# EAGLE design BusPirate-v3.8a-SSOP (EAGLE 6.3)
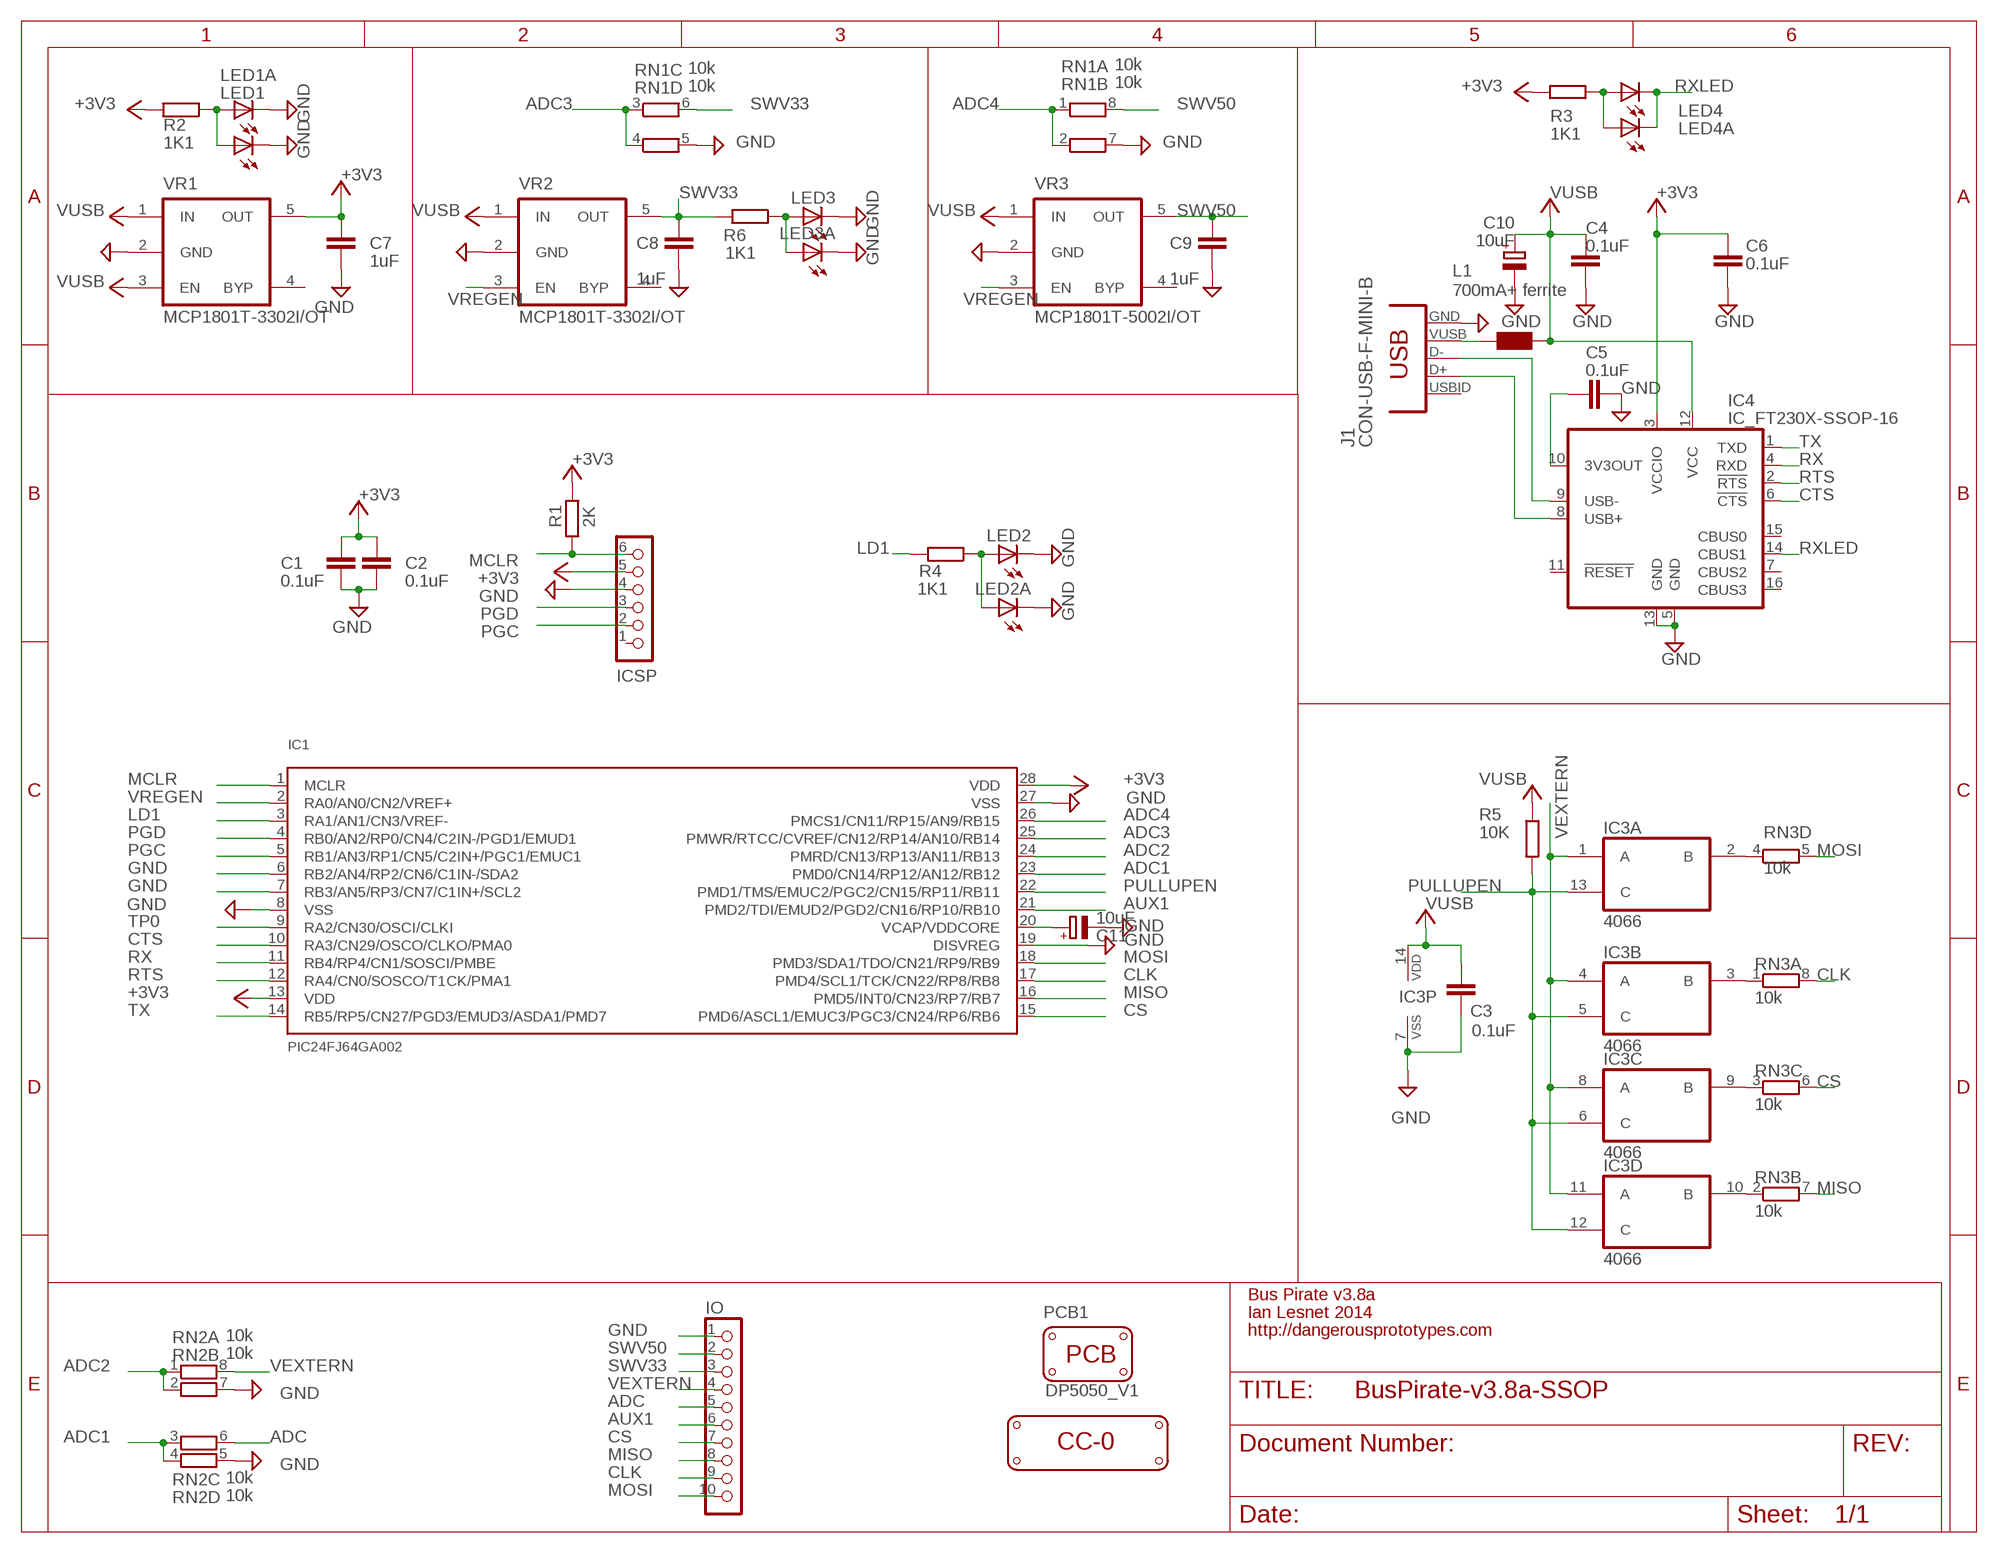
[diagram p0: schematic, sheet 1]

## Parts
C1  0.1uF  CAPC603  [C603]
C2  0.1uF  CAPC603  [C603]
C3  0.1uF  CAPC603  [C603]
C4  0.1uF  CAPC603  [C603]
C5  0.1uF  CAPC603  [C603]
C6  0.1uF  CAPC603  [C603]
C7  1uF  CAPC603  [C603]
C8  1uF  CAPC603  [C603]
C9  1uF  CAPC603  [C603]
C10  10uF  CPOL-EUSMCA  [SMC_A]
C11  10uF  CPOL-EUSMCA  [SMC_A]
IC1  PIC24FJ64GA002  [SSOP28]
IC3  4066  [TSSOP14]
IC4  IC_FT230X-SSOP-16  [SSOP-16-FTDI]
ICSP  CON_HEADER_1X06-SMD-RIGHT-ANGLED  [M1X6_MALE_RIGHT_ANGLED_SMD]
IO  CON_HEADER_1X10-_RIGHTANGLED_SMD  [M1X10_MALE_RIGHT_ANGLED_SMD]
J1  CON-USB-F-MINI-B  [CONN_USB_MINI-B]
L1  700mA+ ferrite  WE-KIL_0805  [WE-KI_0805_B]
LED1  LED-0603  [LED-603]
LED1A  LED-0603  [LED-603]
LED2  LED-0603  [LED-603]
LED2A  LED-0603  [LED-603]
LED3  LED-0603  [LED-603]
LED3A  LED-0603  [LED-603]
LED4  LED-0603  [LED-603]
LED4A  LED-0603  [LED-603]
LOGO1  LOGO_CC-0  [LOGO_CC-0]
PCB1  PCB_DP_SQUARE-5X5  [DP5050_V1]
R1  2K  RESISTORR603  [R603]
R2  1K1  RESISTORR603  [R603]
R3  1K1  RESISTORR603  [R603]
R4  1K1  RESISTORR603  [R603]
R5  10K  RESISTORR603  [R603]
R6  1K1  RESISTORR603  [R603]
RN1  10k  RNETWORK  [RN8P-4R-CRA06S]
RN2  10k  RNETWORK  [RN8P-4R-CRA06S]
RN3  10k  RNETWORK  [RN8P-4R-CRA06S]
VR1  MCP1801T-3302I/OT  MIC5205  [SOT-23-5]
VR2  MCP1801T-3302I/OT  MIC5205  [SOT-23-5]
VR3  MCP1801T-5002I/OT  MIC5205  [SOT-23-5]

## Nets
$N26: J1.VUSB L1.2
+3V3: C1.1 C2.1 C6.1 C7.1 IC1.13(VDD) IC1.28(VDD) IC4.3(VCCIO) ICSP.5 R1.2 R2.2 R3.2 VR1.5(OUT) ; supply symbol labelled SUPPLY_+3V3
ADC: IO.5 RN2.6
ADC1: IC1.23(PMD0/CN14/RP12/AN12/RB12) RN2.3 RN2.4
ADC2: IC1.24(PMRD/CN13/RP13/AN11/RB13) RN2.1 RN2.2
ADC3: IC1.25(PMWR/RTCC/CVREF/CN12/RP14/AN10/RB14) RN1.3 RN1.4
ADC4: IC1.26(PMCS1/CN11/RP15/AN9/RB15) RN1.1 RN1.2
AUX1: IC1.21(PMD2/TDI/EMUD2/PGD2/CN16/RP10/RB10) IO.6
CLK: IC1.17(PMD4/SCL1/TCK/CN22/RP8/RB8) IO.9 RN3.8
CS: IC1.15(PMD6/ASCL1/EMUC3/PGC3/CN24/RP6/RB6) IO.7 RN3.6
CTS: IC1.10(RA3/CN29/OSCO/CLKO/PMA0) IC4.6(!CTS)
GND: C1.2 C2.2 C3.2 C4.2 C5.2 C6.2 C7.2 C8.2 C9.2 C10.- C11.- IC1.6(RB2/AN4/RP2/CN6/C1IN-/SDA2) IC1.7(RB3/AN5/RP3/CN7/C1IN+/SCL2) IC1.8(VSS) IC1.19(DISVREG) IC1.27(VSS) IC3.7(P:VSS) IC4.5(GND) IC4.13(GND) ICSP.4 IO.1 J1.GND LED1.C LED1A.C LED2.C LED2A.C LED3.C LED3A.C RN1.5 RN1.7 RN2.5 RN2.7 VR1.2(GND) VR2.2(GND) VR3.2(GND)
LD1: IC1.3(RA1/AN1/CN3/VREF-) R4.2
MCLR: IC1.1(MCLR) ICSP.6 R1.1
MISO: IC1.16(PMD5/INT0/CN23/RP7/RB7) IO.8 RN3.7
MOSI: IC1.18(PMD3/SDA1/TDO/CN21/RP9/RB9) IO.10 RN3.5
N$1: IC3.2(A:B) RN3.4
N$2: IC3.9(C:B) RN3.3
N$3: C11.+ IC1.20(VCAP/VDDCORE)
N$4: IC3.10(D:B) RN3.2
N$5: IC3.3(B:B) RN3.1
N$6: LED2.A LED2A.A R4.1
N$7: LED1.A LED1A.A R2.1
N$8: C5.1 IC4.10(3V3OUT)
N$13: LED4.A LED4A.A R3.1
N$15: IC4.8(USB+) J1.D+
N$16: IC4.9(USB-) J1.D-
N$18: LED3.A LED3A.A R6.1
PGC: IC1.5(RB1/AN3/RP1/CN5/C2IN+/PGC1/EMUC1) ICSP.2
PGD: IC1.4(RB0/AN2/RP0/CN4/C2IN-/PGD1/EMUD1) ICSP.3
PULLUPEN: IC1.22(PMD1/TMS/EMUC2/PGC2/CN15/RP11/RB11) IC3.5(B:C) IC3.6(C:C) IC3.12(D:C) IC3.13(A:C) R5.2
RTS: IC1.12(RA4/CN0/SOSCO/T1CK/PMA1) IC4.2(!RTS)
RX: IC1.11(RB4/RP4/CN1/SOSCI/PMBE) IC4.4(RXD)
RXLED: IC4.14(CBUS1) LED4.C LED4A.C
SWV33: C8.1 IO.3 R6.2 RN1.6 VR2.5(OUT)
SWV50: C9.1 IO.2 RN1.8 VR3.5(OUT)
TP0: IC1.9(RA2/CN30/OSCI/CLKI)
TX: IC1.14(RB5/RP5/CN27/PGD3/EMUD3/ASDA1/PMD7) IC4.1(TXD)
VEXTERN: IC3.1(A:A) IC3.4(B:A) IC3.8(C:A) IC3.11(D:A) IO.4 RN2.8
VREGEN: IC1.2(RA0/AN0/CN2/VREF+) VR2.3(EN) VR3.3(EN)
VUSB: C3.1 C4.1 C10.+ IC3.14(P:VDD) IC4.12(VCC) L1.1 R5.1 VR1.1(IN) VR1.3(EN) VR2.1(IN) VR3.1(IN) ; supply symbol labelled SUPPLY_VUSB
Unconnected: IC4.7(CBUS2) IC4.11(!RESET) IC4.15(CBUS0) IC4.16(CBUS3) ICSP.1 J1.BODY@1(BODY) J1.BODY@2(BODY) J1.BODY@3(BODY) J1.BODY@4(BODY) J1.ID(USBID) VR1.4(BYP) VR2.4(BYP) VR3.4(BYP)

## Notes on the sheet
- Bus Pirate v3.8a
- Ian Lesnet 2014
- http://dangerousprototypes.com

## Library data of the parts
C1-C9 = dp_devices:CAP
C10 C11 = rcl:CPOL-EU: POLARIZED CAPACITOR, European symbol
IC1 = dp_devices:PIC24FJ64GA002: 16-bit General Purpose Flash Microcontroller
IC3 = 40xx:4066: Quad bilateral ANALOG SWITCH
IC4 = dp_devices.v6:IC_FT230X: BASIC USB to UART IC
ICSP = dp_devices.v6:CON_HEADER_1X06
IO = dp_devices.v6:CON_HEADER_1X10
J1 = dp_devices.v6:CON-USB-F: USB Female connector
L1 = wuerth-elektronik:WE-KIL: SMD Wire Wound Ceramic Inductor WE-KIL - Low profile - High Q values -- Bluetooth -- Wireless LAN -- RF oscillation circuit -- IF impedance matching
LED1 LED1A LED2 LED2A LED3 LED3A LED4 LED4A = dp_devices:LED: Light Emitting Diode
LOGO1 = dp_devices:LOGO_CC-0
PCB1 = dp_devices.v6:PCB_DP_SQUARE: Dangerous Prototypes Standard Square PCB sizes; PCB_SIZE: DP5050_V1
R1-R6 = dp_devices:RESISTOR
RN1-RN3 = dp_devices:RNETWORK: 4 Resistor Array 0603
VR1-VR3 = dp_devices:MIC5205: 150ma Low-Noise LDO Regulator

## Board
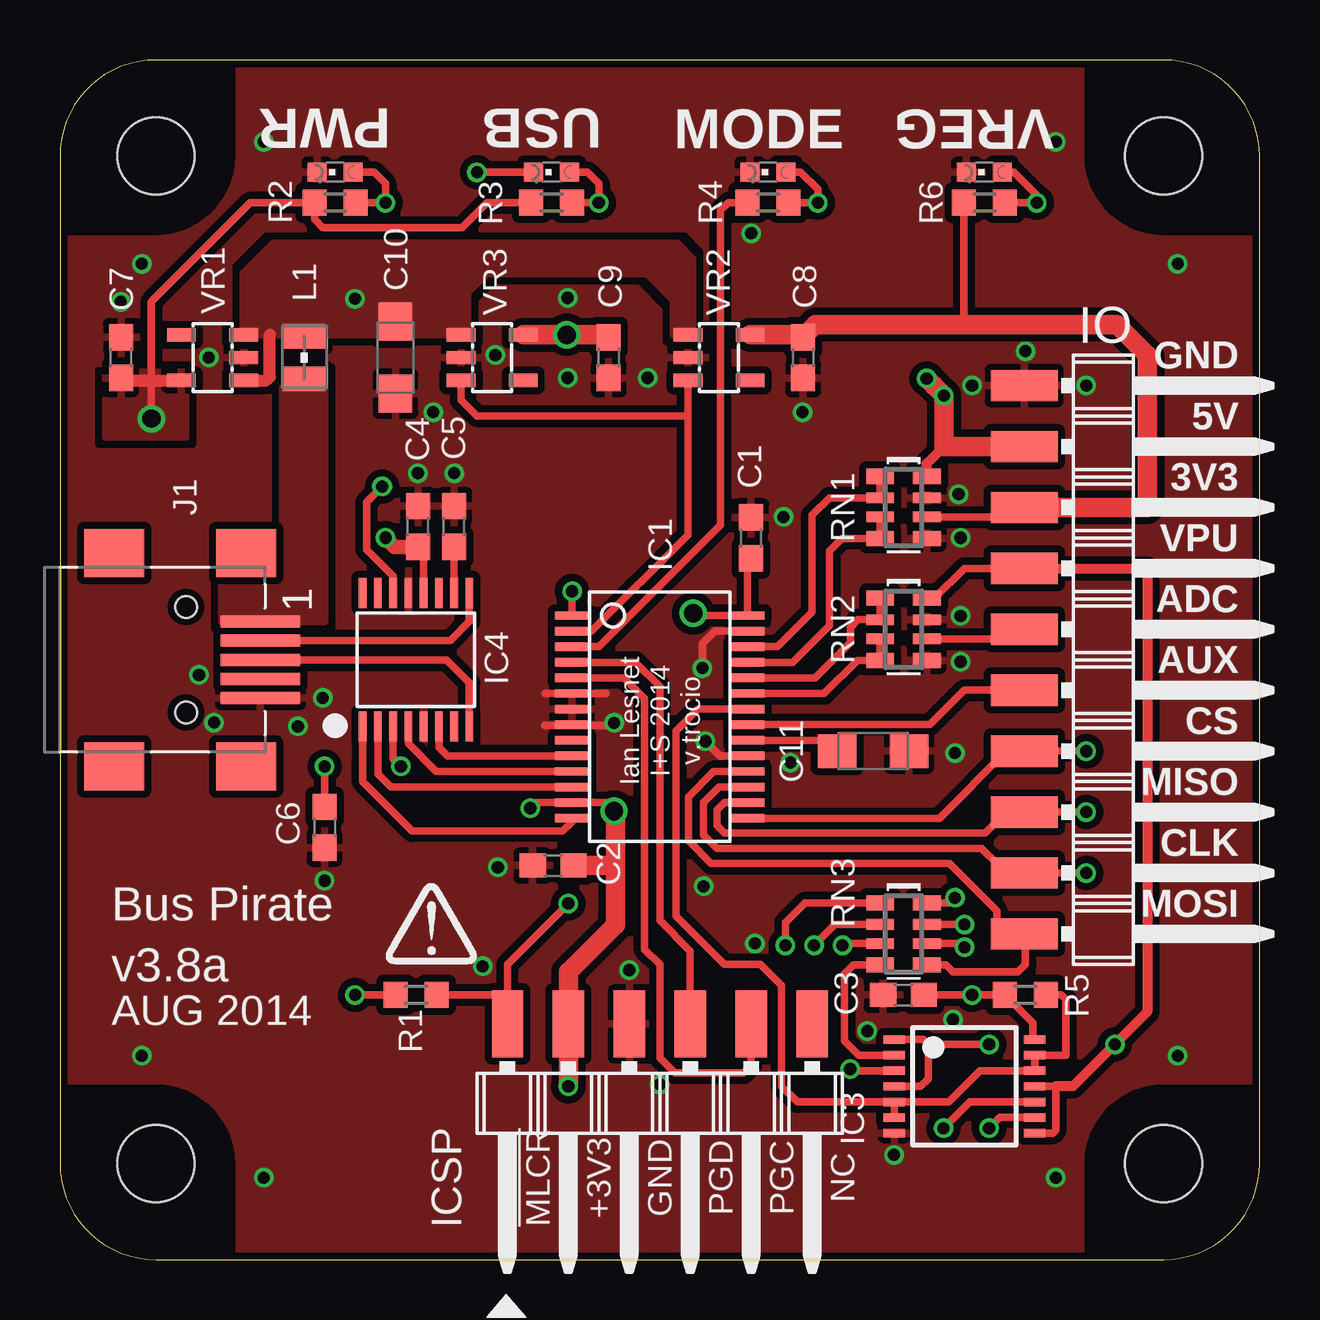
[diagram p1: board, top side]
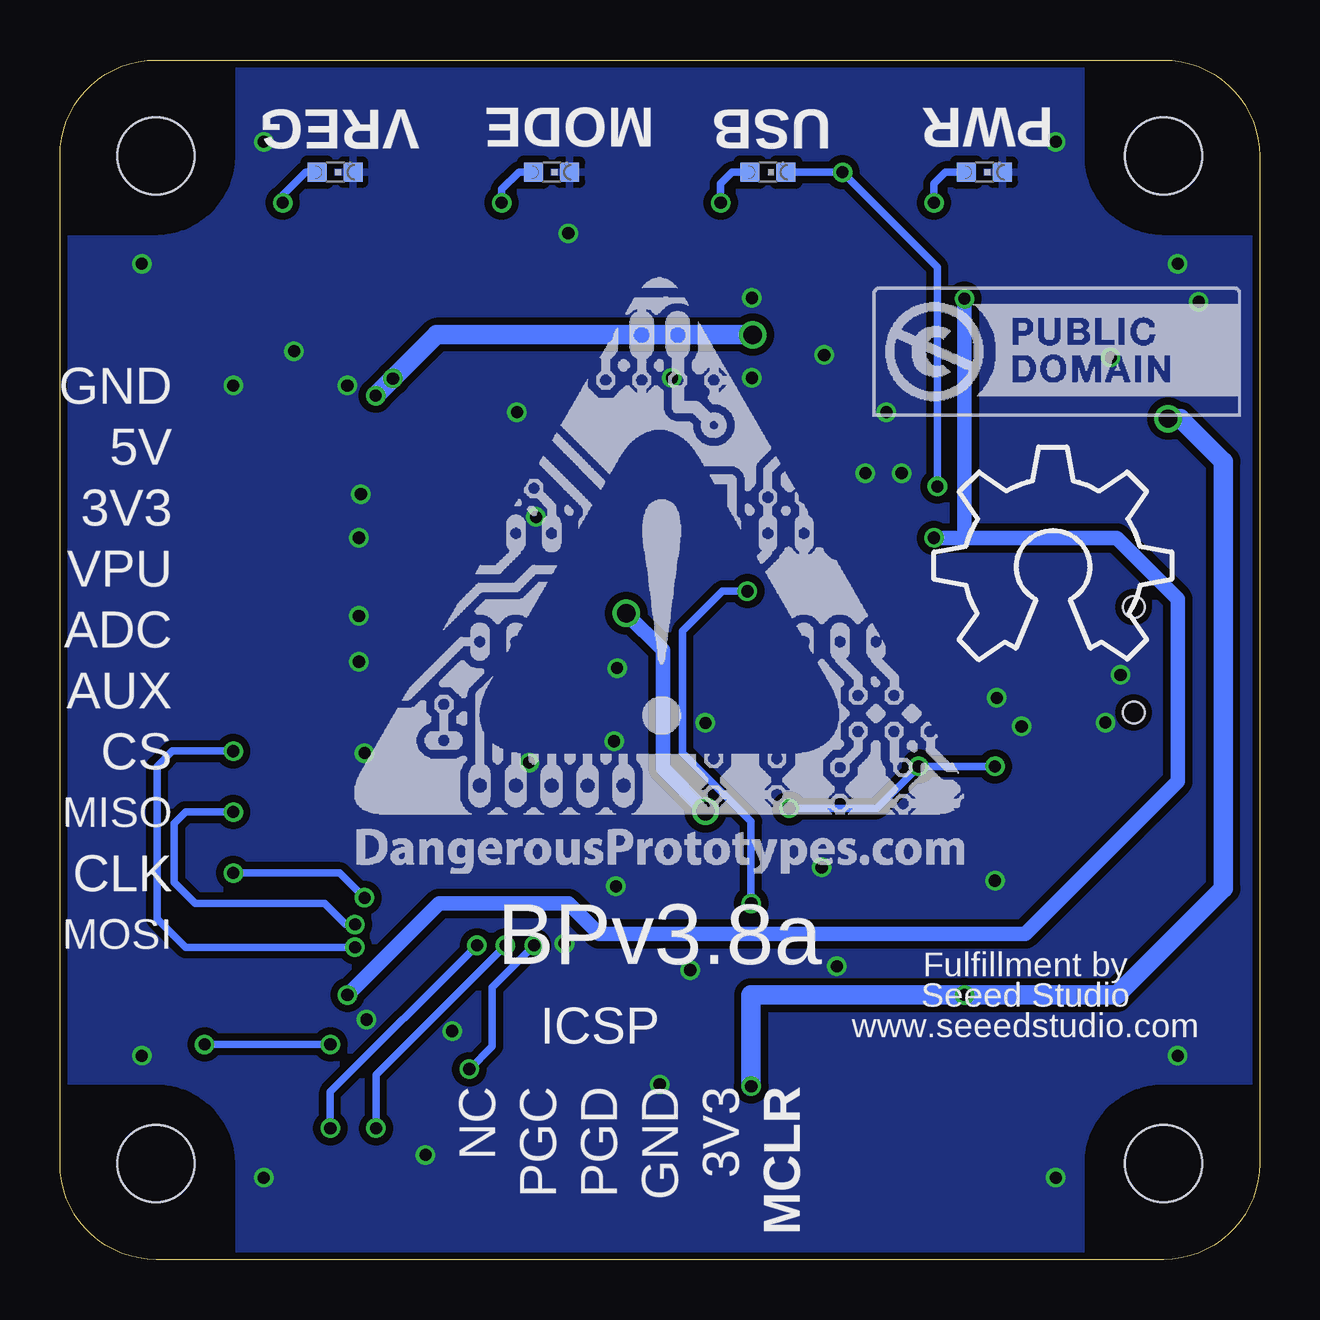
[diagram p2: board, bottom side, seen from below]

Size 50 x 50 mm. Coordinates in mm from the lower left corner, seen from the top.
Copper layers (1*16): Top 0.035mm / dielectric 1.5mm / Bottom 0.035mm
Design rules "dirt_cheap_dirty_boards.v1": minimum track width 5mil, minimum drill 12mil, track to track 5mil, track to pad 5mil, pad to pad 5mil, via to via 5mil, smd to smd 0mil, copper to edge 10mil, drill to drill 10mil, minimum pad ring 10mil, minimum via ring 6mil, stop-mask expansion 2mil, vias tented up to drill 25mil, thermal gap 10mil

### Footprints (pad centres in the part's own frame; a part is rotated, then mirrored left to right if it is on the bottom)
C603 = smd 1.1 x 1: 1 -0.85,0; 2 0.85,0
SMC_A = smd 1.6 x 1.4: + -1.5,0; - 1.5,0
SSOP28 = smd 0.348 x 1.397: 1 -4.225,-3.656; 2 -3.575,-3.656; 3 -2.925,-3.656; 4 -2.275,-3.656; 5 -1.625,-3.656; 6 -0.975,-3.656; 7 -0.325,-3.656; 8 0.325,-3.656; 9 0.975,-3.656; 10 1.625,-3.656; 11 2.275,-3.656; 12 2.925,-3.656; 13 3.575,-3.656; 14 4.225,-3.656; 15 4.225,3.656; 16 3.575,3.656; 17 2.925,3.656; 18 2.275,3.656; 19 1.625,3.656; 20 0.975,3.656; 21 0.325,3.656; 22 -0.325,3.656; 23 -0.975,3.656; 24 -1.625,3.656; 25 -2.275,3.656; 26 -2.925,3.656; 27 -3.575,3.656; 28 -4.225,3.656
TSSOP14 = smd 0.35 x 0.9: 1 -1.95,-2.925; 2 -1.3,-2.925; 3 -0.65,-2.925; 4 0,-2.925; 5 0.65,-2.925; 6 1.3,-2.925; 7 1.95,-2.925; 8 1.95,2.925; 9 1.3,2.925; 10 0.65,2.925; 11 0,2.925; 12 -0.65,2.925; 13 -1.3,2.925; 14 -1.95,2.925
SSOP-16-FTDI = smd 0.32 x 1.26: 1 -2.223,-2.779; 2 -1.588,-2.779; 3 -0.953,-2.779; 4 -0.318,-2.779; 5 0.317,-2.779; 6 0.952,-2.779; 7 1.587,-2.779; 8 2.222,-2.779; 9 2.222,2.779; 10 1.587,2.779; 11 0.952,2.779; 12 0.317,2.779; 13 -0.318,2.779; 14 -0.953,2.779; 15 -1.588,2.779; 16 -2.223,2.779
M1X6_MALE_RIGHT_ANGLED_SMD = smd 1.3 x 2.8: 1 -6.35,-3.3; 2 -3.81,-3.3; 3 -1.27,-3.3; 4 1.27,-3.3; 5 3.81,-3.3; 6 6.35,-3.3
M1X10_MALE_RIGHT_ANGLED_SMD = smd 1.3 x 2.8: 1 -11.43,-3.3; 2 -8.89,-3.3; 3 -6.35,-3.3; 4 -3.81,-3.3; 5 -1.27,-3.3; 6 1.27,-3.3; 7 3.81,-3.3; 8 6.35,-3.3; 9 8.89,-3.3; 10 11.43,-3.3
CONN_USB_MINI-B = smd 2 x 2.5: BODY@1 -4.45,2.5; BODY@2 4.45,2.5; BODY@3 4.45,-3; BODY@4 -4.45,-3 | smd 0.5 x 3.3: D+ 0,3.1; D- -0.8,3.1; GND 1.6,3.1; ID 0.8,3.1; VUSB -1.6,3.1 | hole 0.9: -2.2,0; 2.2,0
WE-KI_0805_B = smd 1.02 x 1.78: 1 -0.89,0; 2 0.89,0
LED-603 = smd 0.8 x 0.8: A 0,-0.75; C 0,0.75
DP5050_V1 = hole 3.2: -21,-21; 21,-21; 21,21; -21,21
R603 = smd 1 x 1.1: 1 -0.85,0; 2 0.85,0
RN8P-4R-CRA06S = smd 0.63 x 1.15: 1 -1.295,-0.975; 4 1.295,-0.975; 5 1.295,0.975; 8 -1.295,0.975 | smd 0.44 x 1.15: 2 -0.4,-0.975; 3 0.4,-0.975; 6 0.4,0.975; 7 -0.4,0.975
SOT-23-5 = smd 0.55 x 1.2: 1 -0.95,-1.3; 2 0,-1.3; 3 0.95,-1.3; 4 0.95,1.3; 5 -0.95,1.3

### Placement (x,y rotation side)
C1  28.81,30.08 90 top
C2  20.55,16.42 180 top
C3  35.16,11.03 180 top
C4  14.92,30.56 90 top
C5  16.43,30.56 90 top
C6  11.03,18.02 270 top
C7  2.55,37.59 90 top
C8  30.97,37.59 270 top
C9  22.87,37.59 270 top
C10  13.98,37.59 270 top
C11  33.89,21.19 0 top
IC1  25,22.62 270 top
IC3  37.7,7.22 270 top
IC4  14.84,25 0 top
ICSP  25,6.52 180 top
IO  43.49,25 270 top
J1  5.25,25 270 top
L1  10.17,37.59 270 top
LED1  11.46,45.32 90 top
LED1A  11.46,45.32 270 bottom
LED2  29.51,45.32 90 top
LED2A  29.51,45.32 270 bottom
LED3  38.54,45.32 90 top
LED3A  38.54,45.32 270 bottom
LED4  20.49,45.32 90 top
LED4A  20.49,45.32 270 bottom
LOGO1  16.11,35.16 0 bottom
PCB1  25,25 0 top
R1  14.84,11.03 180 top
R2  11.46,44.05 180 top
R3  20.49,44.05 180 top
R4  29.51,44.05 180 top
R5  40.24,11.03 0 top
R6  38.54,44.05 180 top
RN1  35.16,31.35 270 top
RN2  35.16,26.27 270 top
RN3  35.16,13.57 270 top
U$1  [DP-LOGO]  13.57,12.3 0 top
U$2  [OSHW_8X350_NOTEXT]  13.57,25 0 bottom
U$3  [DP_LOGO_ART_1X1]  37.7,16.11 0 bottom
VR1  6.36,37.59 90 top
VR2  27.47,37.59 270 top
VR3  18.02,37.59 270 top

### Tracks (layer width: path | path; a pad name or v marks a point on that pad's centre or on a via)
$N26
  pour Top (isolate 0.305, no thermals): 6.74,28.81 9.28,28.81 9.28,36.91 11.03,36.91 11.03,26.59 6.74,26.59
+3V3  (via drill 0.51, 0.76)
  Top 0.305: v19.6,18.81 19.84,19.04 IC1.13 22.73,19.04 v23.1,18.68 | R3.2 17.8,44.05 16.77,43.02 10.95,43.02 10.61,43.36 R2.2 7.93,44.05 3.81,39.92 3.81,36.64 | C1.1 28.66,29.23 IC1.28 26.49,26.84 v26.4,26.94 | 3.81,36.64 VR1.5 | v11.03,20.55 C6.1 | IC4.3 13.89,20.87 v14.21,20.55 | v12.3,11.03 R1.2 | v3.81,35.05 3.81,36.64
  Top 0.406: 23.16,16.29 23.03,16.42
  Top 0.508: VR1.5 2.65,36.64 C7.1
  Top 0.61: 23.16,18.62 v23.1,18.68
  Top 0.813: 23.16,18.62 23.16,16.29 23.16,13.96 21.19,11.98 ICSP.5 v21.19,7.22 | C2.1 23.03,16.42
  Bottom 0.305: v19.6,18.81 15.95,18.81 v14.21,20.55 v11.03,20.55
  Bottom 0.61: v26.4,26.94 24.87,25.41 24.87,20.46 v23.1,18.68
  Bottom 0.813: v21.19,7.22 21.19,11.03 v12.3,11.03 5.95,11.03 1.51,15.48 1.51,33.26 3.3,35.05 v3.81,35.05
  pour Top: 1.9,36.99 5.24,36.99 5.24,34.29 1.9,34.29
ADC
  Top 0.305: RN2.6 39.79,25.87 IO.5
ADC1
  Top 0.305: RN2.3 RN2.4 33.23,24.98 31.85,23.59 IC1.23
ADC2
  Top 0.305: RN2.1 RN2.2 33.26,26.67 32.94,26.35 32.94,25.71 31.47,24.24 IC1.24
ADC3
  Top 0.305: RN1.3 RN1.4 32.59,30.05 32.06,29.52 32.06,26.43 30.53,24.89 IC1.25
ADC4
  Top 0.305: RN1.1 RN1.2 32.06,31.75 31.35,31.04 31.35,26.98 29.91,25.54 IC1.26
AUX1
  Top 0.305: IC1.21 36.26,22.29 37.7,23.73 IO.6
CLK  (via drill 0.51)
  Top 0.305: IC1.17 27.47,19.69 26.83,19.05 26.83,17.7 27.38,17.14 38.41,17.14 39.05,16.51 39.8,16.51 IO.9 v42.78,16.11 | RN3.8 37.09,14.87 v37.3,15.08
  Bottom 0.305: v37.3,15.08 38.34,16.11 v42.78,16.11
CS  (via drill 0.51)
  Top 0.305: IC1.15 36.65,18.39 39.45,21.19 IO.7 v42.78,21.19 | RN3.6 37.54,13.17 v37.7,13.01
  Bottom 0.305: v42.78,21.19 45.32,21.19 45.95,20.55 45.95,14.21 44.76,13.01 v37.7,13.01
CTS
  Top 0.305: IC1.10 16.15,20.99 15.79,21.35 IC4.6
GND  (via drill 0.51)
  Top 0.305: v26.78,24.65 26.78,25.67 27.3,26.19 IC1.27 28.53,26.2 | IC1.19 27.51,20.99 v26.91,21.6 | 22.77,23.58 20.23,23.58 20.24,23.59 IC1.6 | 20.2,22.26 22.99,22.26
  other vias: 18.14,37.7 6.2,37.59 30.95,35.32 28.81,42.78 2.54,39.92 26.83,15.55 37.3,21.11 37.54,24.92 23.1,22.36 37.54,30.08 21.16,36.75 24.49,36.75 21.16,40.08 18.25,16.35 38.02,36.43 30.45,20.71 37.22,10 17.62,12.22 42.78,36.43 15.55,35.32 14.92,32.78 16.43,32.78 30.16,30.95 10.95,23.41 9.92,22.22 6.43,22.38 5.79,24.37 11.03,15.79 37.54,26.83 37.46,31.91 3.41,8.49 8.49,3.41 41.51,3.41 46.59,8.49 46.59,41.51 41.51,46.59 8.49,46.59 3.41,41.51 34.76,4.36 28.97,13.17 40.24,37.86 23.73,12.06 25,7.3 33.65,9.52
  pour Top (isolate 0.305, rank 6): 0.01,49.98 50.81,49.98 50.81,-0.82 0.01,-0.82
  pour Bottom (isolate 0.305): 0.01,49.98 50.81,49.98 50.81,-0.82 0.01,-0.82
LD1
  Top 0.305: IC1.3 22.46,25.54 27.54,30.62 27.54,43.73 27.86,44.05 R4.2
MCLR  (via drill 0.51)
  Top 0.305: v21.35,27.86 IC1.1 | R1.1 18.65,11.03 | 18.65,11.03 ICSP.6 | 18.65,11.03 18.65,12.3 v21.19,14.84
  Bottom 0.305: v21.19,14.84 21.19,18.25 24.05,21.11 24.05,26.19 22.38,27.86 v21.35,27.86
MISO  (via drill 0.51)
  Top 0.305: IC1.16 27.7,19.04 27.38,18.73 27.38,18.09 27.7,17.78 38.57,17.78 39.45,18.65 IO.8 v42.78,18.65 | RN3.7 37.47,13.97 v37.7,13.97
  Bottom 0.305: v42.78,18.65 44.76,18.65 45.24,18.17 45.24,15.71 44.37,14.84 38.97,14.84 38.1,13.97 v37.7,13.97
MOSI
  Top 0.305: IC1.18 27.25,20.34 26.19,19.29 26.19,17.46 27.14,16.51 37.07,16.51 39.05,14.52 39.05,13.65 38.97,13.57 IO.10 40.24,13.52 40.24,12.3 39.92,11.98 37.22,11.98 36.93,12.28 RN3.5
N$1
  Top 0.305: RN3.4 33.07,12.28 32.7,11.9 32.7,9.13 33.3,8.52 IC3.2
N$2  (via drill 0.51)
  Top 0.305: IC3.9 39.18,5.92 v38.73,5.47 | RN3.3 32.7,13.17 v32.62,13.09
  Bottom 0.305: v38.73,5.47 38.73,6.98 v32.62,13.09
N$3
  Top 0.305: IC1.20 32.09,21.64 C11.+
N$4  (via drill 0.51)
  Top 0.305: IC3.10 37.92,6.57 v36.83,5.47 | RN3.2 32.31,13.97 v31.43,13.09
  Bottom 0.305: v36.83,5.47 36.83,7.7 v31.43,13.09
N$5  (via drill 0.51)
  Top 0.305: IC3.3 33,7.87 v32.94,7.93 | RN3.1 31.06,14.87 30.24,14.05 v30.24,13.09
  Bottom 0.305: v30.24,13.09 31.98,11.35 31.98,8.89 v32.94,7.93
N$6  (via drill 0.51)
  Top 0.305: R4.1 v31.59,44.05 31.59,44.61 30.87,45.32 LED2A.A
  Bottom 0.305: LED2A.A 30.87,45.32 31.59,44.61 v31.59,44.05
N$7  (via drill 0.51)
  Top 0.305: R2.1 v13.57,44.05 13.57,44.84 13.09,45.32 LED1A.A
  Bottom 0.305: LED1A.A 13.09,45.32 13.57,44.84 v13.57,44.05
N$8
  Top 0.305: IC4.10 C5.1
N$13  (via drill 0.51)
  Top 0.305: R3.1 v22.46,44.05 22.46,44.84 21.98,45.32 LED4A.A
  Bottom 0.305: LED4A.A 21.98,45.32 22.46,44.84 v22.46,44.05
N$15
  Top 0.305: J1.D+ 16.11,25 17.06,24.05 IC4.8
N$16
  Top 0.305: J1.D- 16.28,25.8 17.06,26.59 IC4.9
N$18  (via drill 0.51)
  Top 0.305: R6.1 v40.72,44.05 40.72,44.37 39.76,45.32 LED3A.A
  Bottom 0.305: LED3A.A 39.76,45.32 40.72,44.37 v40.72,44.05
PGC
  Top 0.305: IC1.5 23.5,24.24 24.37,23.38 24.37,12.94 25,12.3 25,8.41 25.64,7.78 28.49,7.78 28.81,8.09 ICSP.2
PGD
  Top 0.305: IC1.4 24,24.89 25,23.89 25,14.13 26.27,12.86 ICSP.3
PULLUPEN
  Top 0.305: IC3.6 IC3.5 | IC1.22 26.6,22.94 25.68,22.03 25.68,14.32 27.7,12.3 29.21,12.3 30.08,11.43 30.08,7.22 30.73,6.57 IC3.5 | IC3.5 37.05,6.57 38.35,7.87 IC3.12 IC3.13 41.94,8.52 41.94,10.84 41.75,11.03 R5.2
RTS
  Top 0.305: IC1.12 13.8,19.69 13.25,20.24 IC4.2
RX
  Top 0.305: IC1.11 15.69,20.34 14.52,21.51 IC4.4
RXLED  (via drill 0.51)
  Top 0.305: LED4A.C v17.38,45.32 | IC4.14 13.89,28.49 12.78,29.6 12.78,31.57 v13.43,32.22
  Bottom 0.305: LED4A.C v17.38,45.32 13.43,41.37 v13.43,32.22
SWV33
  Top 0.305: RN1.6 39.79,30.95 IO.3 | R6.2 37.69,38.98 37.7,38.97
  Top 0.508: 30.87,38.54 C8.1
  Top 0.813: VR2.5 30.87,38.54 | C8.1 31.5,38.97 37.7,38.97 44.05,38.97 45.32,37.7 45.32,31.35 IO.3
SWV50  (via drill 0.51, 0.76)
  Top 0.406: RN1.8 36.13,33.18 36.84,33.89
  Top 0.508: 22.8,38.59 22.83,38.59 22.87,38.55
  Top 0.61: 22.8,38.59 C9.1
  Top 0.813: VR3.5 20.24,38.54 v21.13,38.55 22.87,38.55 | IO.2 36.84,33.89 v36.84,36.01 | 36.43,36.42 v36.84,36.01 | v36.13,36.72 v36.84,36.01
  Bottom 0.813: v21.13,38.55 34.3,38.55 v36.84,36.01
TX
  Top 0.305: IC4.1 12.62,20.79 12.62,19.92 14.68,17.86 20.95,17.86 21.34,18.25 IC1.14
VEXTERN  (via drill 0.51)
  Top 0.305: IC3.8 41.39,5.27 41.51,5.39 41.51,7.2 | v38.73,8.97 36.19,8.97 | IO.4 37.7,28.81 36.45,27.57 RN2.8 | IC3.1 35.99,9.17 36.19,8.97 | 36.19,8.97 36.19,7.54 35.87,7.22 IC3.4 | 41.51,7.2 41.53,7.22 | IC3.11 41.49,7.22 41.51,7.2
  Top 0.406: 41.53,7.22 42.22,7.22 v43.97,8.97 45.32,10.32 45.32,28.81 IO.4
  Bottom 0.305: v38.73,8.97 v43.97,8.97
VREGEN
  Top 0.305: 16.71,35.83 17.38,35.16 26.17,35.16 | IC1.2 22.16,26.19 26.17,30.2 26.17,35.16 | 16.71,35.83 VR3.3 | 16.71,35.83 | 26.17,35.16 VR2.3
VUSB  (via drill 0.51)
  Top 0.305: IC4.12 15.16,29.47 C4.1 | 40.56,9.2 40.56,9.86 R5.1 v38.02,11.03 C3.1 | 40.59,9.17 40.56,9.2 | IC3.14 40.56,9.17 40.56,9.2
  Top 0.508: VR1.1 8.59,36.64 8.74,36.8 8.74,38.55 8.74,38.54
  Top 0.61: v13.57,30.08 13.94,29.71 C4.1
  Bottom 0.61: v12.3,40.05 12.3,30.08 v13.57,30.08 5.95,30.08 3.41,27.54 3.41,19.92 9.76,13.57 27.54,13.57 28.81,14.84 34.21,14.84 v38.02,11.03
  pour Top (isolate 0.305, no thermals): 7.63,41.09 7.63,38.55 17,38.55 17,40.29 17.79,41.09 24.46,41.09 25.57,39.98 25.57,38.55 26.36,38.55 26.36,41.72 25.73,42.36 8.9,42.36

### Text on the board
tPlace: GND | 5V | 3V3 | VPU | ADC | AUX | CS | MISO | CLK | MOSI | !MLCR | +3V3 | GND | PGD | PGC | NC
tNames: PWR | USB | MODE | VREG | Ian Lesnet | I+S 2014 | v.trocio | Bus Pirate | v3.8a | AUG 2014
bNames: PWR | USB | MODE | VREG | GND | 5V | 3V3 | VPU | ADC | AUX | CS | MISO | CLK | BPv3.8a | MOSI | Fulfillment by | Seeed Studio | www.seeedstudio.com | ICSP | MCLR | 3V3 | GND | PGD | PGC | NC
Reference: I/O header | GND | 5V | 3V3 | VPU | ADC | AUX | CS | MISO | CLK | MOSI | Bus Pirate v3.8a | Ian Lesnet | CC-0 | AUG 2014 | http://dangerousprototypes.com | MCLR | +3.3V | GND | DATA | CLOCK | NC | ICSP Programming Header